# EAGLE design RaspberryPiSocket (EAGLE 7.5.0)
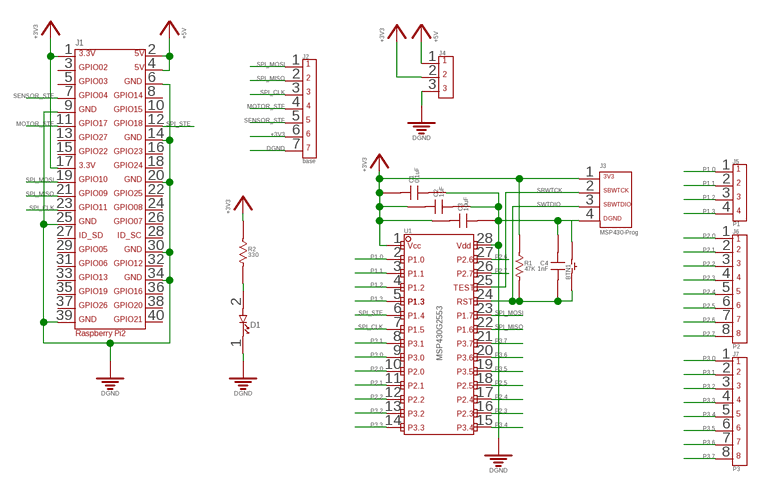
[diagram p0: schematic, sheet 1]

## Parts
BTN1  BTN_NORMAL_OFF_6_3.5_SMD  [BTN_6_3.5_SMD]
C1  0.1uF  CAPACITOR_FIXED_0805  [0805]
C2  1uF  CAPACITOR_FIXED_0805  [0805]
C3  10uF  CAPACITOR_FIXED_0805  [0805]
C4  1nF  CAPACITOR_FIXED_0805  [0805]
D1  LED_0805  [0805DIODE]
J1  RPI2  [RPI2]
J2  base  7PIN_HEADER_VERT_PITCH2.54MM_TH  [7PIN_HEADER_VERT_PITCH2.54MM_TH]
J3  MSP430-PROG_NORMAL  [4PIN_HEADER_PITCH2.54MM_TH]
J4  3PIN_HEADER_PITCH2.54MM_TH  [3PIN_HEADER_PITCH2.54MM_TH]
J5  P1  4PIN_HEADER_PITCH2.54MM_TH  [4PIN_HEADER_PITCH2.54MM_TH]
J6  P2  8PIN_HEADER_PITCH2.54MM_TH  [8PIN_HEADER_PITCH2.54MM_TH]
J7  P3  8PIN_HEADER_PITCH2.54MM_TH  [8PIN_HEADER_PITCH2.54MM_TH]
R1  47K  RESISTOR_0805  [0805]
R2  330  RESISTOR_0805  [0805]
U1  MSP430G2553_24IO_28PIN_TSSOP  [TSSOP-28]

## Nets
+3V3: C1.1 C2.1 C3.1 J1.1 J1.17 J2.6 J3.1 J4.2 R1.1 R2.1 U1.1
+5V: J1.2 J1.4 J4.1
DGND: BTN1.2 C1.2 C2.2 C3.2 C4.1 D1.1 J1.6 J1.9 J1.14 J1.20 J1.25 J1.30 J1.34 J1.39 J2.7 J3.4 J4.3 U1.28
MOTOR_STE: J1.11 J2.4
N$1: D1.2 R2.2
P1.0: J5.1 U1.2
P1.1: J5.2 U1.3
P1.2: J5.3 U1.4
P1.3: J5.4 U1.5
P2.0: J6.1 U1.10
P2.1: J6.2 U1.11
P2.2: J6.3 U1.12
P2.3: J6.4 U1.16
P2.4: J6.5 U1.17
P2.5: J6.6 U1.18
P2.6: J6.7 U1.27
P2.7: J6.8 U1.26
P3.0: J7.1 U1.9
P3.1: J7.2 U1.8
P3.2: J7.3 U1.13
P3.3: J7.4 U1.14
P3.4: J7.5 U1.15
P3.5: J7.6 U1.19
P3.6: J7.7 U1.20
P3.7: J7.8 U1.21
SBWTCK: J3.2 U1.25
SENSOR_STE: J1.7 J2.5
SPI_CLK: J1.23 J2.3 U1.7
SPI_MISO: J1.21 J2.2 U1.22
SPI_MOSI: J1.19 J2.1 U1.23
SPI_STE: J1.12 U1.6
SWTDIO: BTN1.1 C4.2 J3.3 R1.2 U1.24
Unconnected: J1.3 J1.5 J1.8 J1.10 J1.13 J1.15 J1.16 J1.18 J1.22 J1.24 J1.26 J1.27 J1.28 J1.29 J1.31 J1.32 J1.33 J1.35 J1.36 J1.37 J1.38 J1.40

## Library data of the parts
BTN1 = Switches:BTN_NORMAL_OFF
C1-C4 = Capacitors:CAPACITOR_FIXED
D1 = ivani_lib:LED
J1 = robot_lib:RPI2
J2 = Connectors:7PIN
J3 = Connectors:MSP430-PROG
J4 = Connectors:3PIN
J5 = Connectors:4PIN
J6 J7 = Connectors:8PIN
R1 R2 = Resistors:RESISTOR
U1 = MCUs:MSP430G2553_24IO_28PIN

## Board
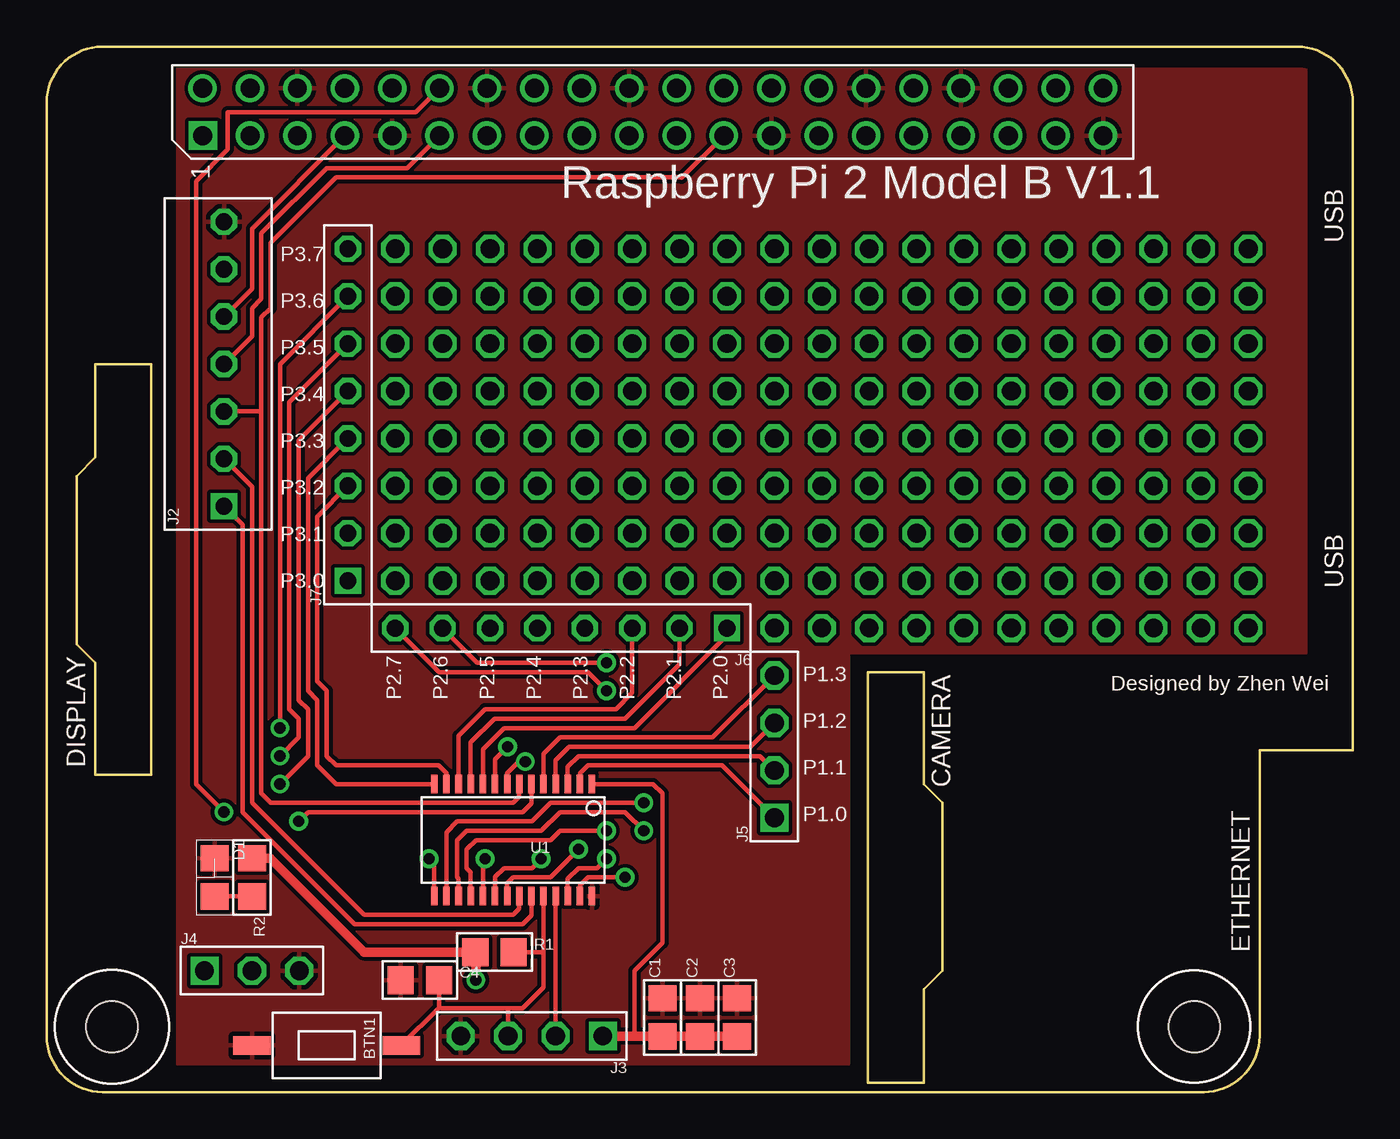
[diagram p1: board, top side]
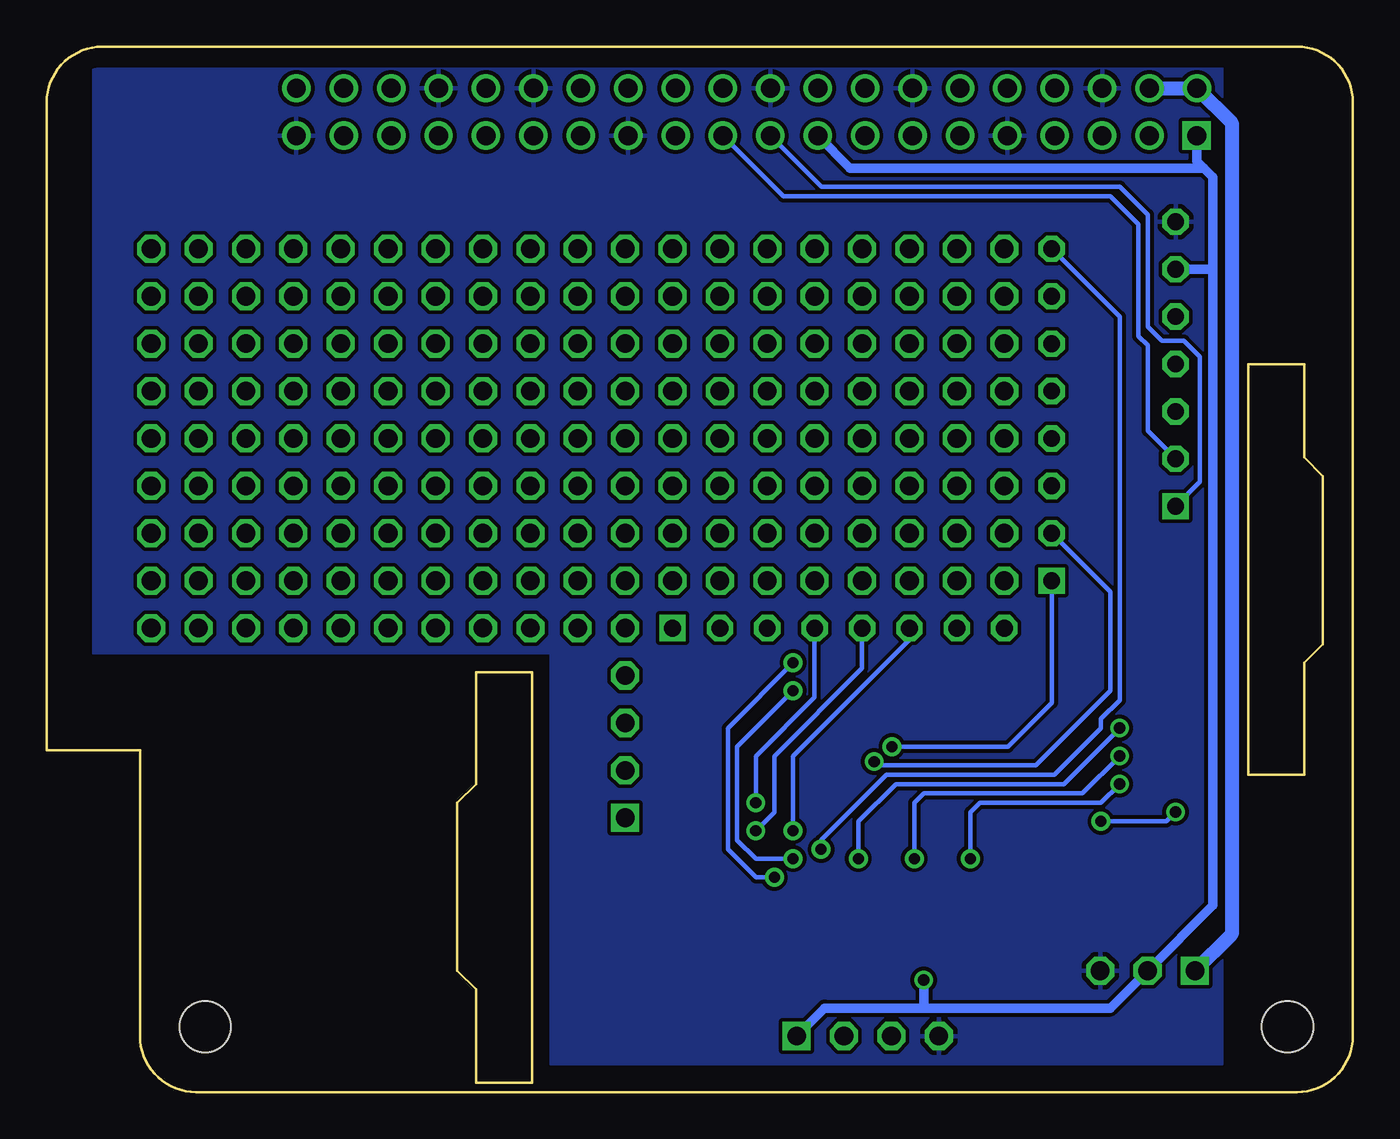
[diagram p2: board, bottom side, seen from below]

Size 70 x 56 mm. Coordinates in mm from the lower left corner, seen from the top.
Copper layers (1*16): Top 0.035mm / dielectric 1.5mm / Bottom 0.035mm
Design rules "default": minimum track width 10mil, minimum drill 24mil, track to track 8mil, track to pad 8mil, pad to pad 8mil, via to via 8mil, smd to smd 8mil, copper to edge 40mil, drill to drill 8mil, minimum pad ring 10mil, minimum via ring 8mil, stop-mask expansion 4mil, vias tented up to drill 0mil, thermal gap 10mil

### Footprints (pad centres in the part's own frame; a part is rotated, then mirrored left to right if it is on the bottom)
BTN_6_3.5_SMD = smd 1 x 2: 1 0,4; 2 0,-4
0805 = smd 1.4 x 1.5: 1 -1.025,0; 2 1.025,0
0805DIODE = smd 1.4 x 1.5: 1 -1.025,0; 2 1.025,0
RPI2 = drill 1.016 square: 1 8.37,51.23 | drill 1.016: 2 8.357,53.772; 3 10.897,51.232; 4 10.897,53.772; 5 13.437,51.232; 6 13.437,53.772; 7 15.977,51.232; 8 15.977,53.772; 9 18.517,51.232; 10 18.517,53.772; 11 21.057,51.232; 12 21.057,53.772; 13 23.597,51.232; 14 23.597,53.772; 15 26.137,51.232; 16 26.137,53.772; 17 28.677,51.232; 18 28.677,53.772; 19 31.217,51.232; 20 31.217,53.772; 21 33.757,51.232; 22 33.757,53.772; 23 36.297,51.232; 24 36.297,53.772; 25 38.837,51.232; 26 38.837,53.772; 27 41.377,51.232; 28 41.377,53.772; 29 43.917,51.232; 30 43.917,53.772; 31 46.457,51.232; 32 46.457,53.772; 33 48.997,51.232; 34 48.997,53.772; 35 51.537,51.232; 36 51.537,53.772; 37 54.077,51.232; 38 54.077,53.772; 39 56.617,51.232; 40 56.617,53.772 | hole 2.75: 3.5,3.5; 61.5,3.5
7PIN_HEADER_VERT_PITCH2.54MM_TH = drill 0.9 square: 1 -7.62,0 | drill 0.9 octagon: 2 -5.08,0; 3 -2.54,0; 4 0,0; 5 2.54,0; 6 5.08,0; 7 7.62,0
4PIN_HEADER_PITCH2.54MM_TH = drill 1 square: 1 -3.81,0 | drill 1 octagon: 2 -1.27,0; 3 1.27,0; 4 3.81,0
3PIN_HEADER_PITCH2.54MM_TH = drill 1 square: 1 -2.54,0 | drill 1 octagon: 2 0,0; 3 2.54,0
8PIN_HEADER_PITCH2.54MM_TH = drill 0.9 square: 1 -8.89,0 | drill 0.9 octagon: 2 -6.35,0; 3 -3.81,0; 4 -1.27,0; 5 1.27,0; 6 3.81,0; 7 6.35,0; 8 8.89,0
TSSOP-28 = smd 0.35 x 1: 1 -4.225,-3; 2 -3.575,-3; 3 -2.925,-3; 4 -2.275,-3; 5 -1.625,-3; 6 -0.975,-3; 7 -0.325,-3; 8 0.325,-3; 9 0.975,-3; 10 1.625,-3; 11 2.275,-3; 12 2.925,-3; 13 3.575,-3; 14 4.225,-3; 15 4.225,3; 16 3.575,3; 17 2.925,3; 18 2.275,3; 19 1.625,3; 20 0.975,3; 21 0.325,3; 22 -0.325,3; 23 -0.975,3; 24 -1.625,3; 25 -2.275,3; 26 -2.925,3; 27 -3.575,3; 28 -4.225,3

### Placement (x,y rotation side)
BTN1  15,2.5 270 top
C1  33,4 90 top
C2  35,4 90 top
C3  37,4 90 top
C4  20,6 0 top
D1  9,11.5 270 top
J1  0,0 0 top
J2  9.5,39 90 top
J3  26,3 180 top
J4  11,6.5 0 top
J5  39,18.5 90 top
J6  27.57,24.85 180 top
J7  16.14,36.28 90 top
R1  24,7.5 0 top
R2  11,11.5 270 top
U1  25,13.5 180 top

### Tracks (layer width: path | path; a pad name or v marks a point on that pad's centre or on a via)
+3V3  (via drill 0.6)
  Top 0.254: U1.1 32.5,16.5 33,16 33,8 31.5,6.5 31.5,3
  Top 0.508: C3.1 C2.1 C1.1 32.98,3 31.5,3 J3.1 | v23,6 23,7.47 R1.1 17,7.5 11.97,12.53 R2.1
  Bottom 0.508: J2.6 7.5,44.08 | J3.1 28.31,4.5 23,4.5 | 23,4.5 13,4.5 J4.2 7.5,10 7.5,44.08 | 8,49.5 26.95,49.5 J1.17 | 8,49.5 7.5,49 7.5,44.08 | 8,49.5 8.37,49.87 J1.1 | v23,6 23,4.5
+5V
  Bottom 0.756: J1.4 J1.2 6.5,51.91 6.5,8.46 J4.1
DGND
  pour Top: 7,55 67.5,55 67.5,23.5 43,23.5 43,1.5 7,1.5
  pour Bottom: 7,55 67.5,55 67.5,23.5 43,23.5 43,1.5 7,1.5
MOTOR_STE
  Top 0.254: J2.4 11,40.5 11,42 11.5,42.5 11.5,46 15,49.5 19.32,49.5 J1.11
N$1
  Top 0.254: R2.2 D1.2
N$2  (via drill 1)
  other vias: 18.68,35.01
N$3  (via drill 1)
  other vias: 18.68,27.39
N$4  (via drill 1)
  other vias: 18.68,29.93
N$5  (via drill 1)
  other vias: 18.68,32.47
N$6  (via drill 1)
  other vias: 18.68,37.55
N$7  (via drill 1)
  other vias: 18.68,40.09
N$8  (via drill 1)
  other vias: 18.68,42.63
N$9  (via drill 1)
  other vias: 18.68,45.17
N$10  (via drill 1)
  other vias: 21.22,27.39
N$11  (via drill 1)
  other vias: 21.22,29.93
N$12  (via drill 1)
  other vias: 21.22,32.47
N$13  (via drill 1)
  other vias: 21.22,35.01
N$14  (via drill 1)
  other vias: 21.22,37.55
N$15  (via drill 1)
  other vias: 21.22,40.09
N$16  (via drill 1)
  other vias: 21.22,42.63
N$17  (via drill 1)
  other vias: 21.22,45.17
N$18  (via drill 1)
  other vias: 23.76,27.39
N$19  (via drill 1)
  other vias: 23.76,29.93
N$20  (via drill 1)
  other vias: 23.76,32.47
N$21  (via drill 1)
  other vias: 23.76,35.01
N$22  (via drill 1)
  other vias: 23.76,37.55
N$23  (via drill 1)
  other vias: 23.76,40.09
N$24  (via drill 1)
  other vias: 23.76,42.63
N$25  (via drill 1)
  other vias: 23.76,45.17
N$26  (via drill 1)
  other vias: 26.3,27.39
N$27  (via drill 1)
  other vias: 26.3,29.93
N$28  (via drill 1)
  other vias: 26.3,32.47
N$29  (via drill 1)
  other vias: 26.3,35.01
N$30  (via drill 1)
  other vias: 26.3,37.55
N$31  (via drill 1)
  other vias: 26.3,40.09
N$32  (via drill 1)
  other vias: 26.3,42.63
N$33  (via drill 1)
  other vias: 26.3,45.17
N$34  (via drill 1)
  other vias: 28.84,27.39
N$35  (via drill 1)
  other vias: 28.84,29.93
N$36  (via drill 1)
  other vias: 28.84,32.47
N$37  (via drill 1)
  other vias: 28.84,35.01
N$38  (via drill 1)
  other vias: 28.84,37.55
N$39  (via drill 1)
  other vias: 28.84,40.09
N$40  (via drill 1)
  other vias: 28.84,42.63
N$41  (via drill 1)
  other vias: 28.84,45.17
N$42  (via drill 1)
  other vias: 31.38,27.39
N$43  (via drill 1)
  other vias: 31.38,29.93
N$44  (via drill 1)
  other vias: 31.38,32.47
N$45  (via drill 1)
  other vias: 31.38,35.01
N$46  (via drill 1)
  other vias: 31.38,37.55
N$47  (via drill 1)
  other vias: 31.38,40.09
N$48  (via drill 1)
  other vias: 31.38,42.63
N$49  (via drill 1)
  other vias: 31.38,45.17
N$50  (via drill 1)
  other vias: 33.92,27.39
N$51  (via drill 1)
  other vias: 33.92,29.93
N$52  (via drill 1)
  other vias: 33.92,32.47
N$53  (via drill 1)
  other vias: 33.92,35.01
N$54  (via drill 1)
  other vias: 33.92,37.55
N$55  (via drill 1)
  other vias: 33.92,40.09
N$56  (via drill 1)
  other vias: 33.92,42.63
N$57  (via drill 1)
  other vias: 33.92,45.17
N$58  (via drill 1)
  other vias: 36.46,27.39
N$59  (via drill 1)
  other vias: 36.46,29.93
N$60  (via drill 1)
  other vias: 36.46,32.47
N$61  (via drill 1)
  other vias: 36.46,35.01
N$62  (via drill 1)
  other vias: 36.46,37.55
N$63  (via drill 1)
  other vias: 36.46,40.09
N$64  (via drill 1)
  other vias: 36.46,42.63
N$65  (via drill 1)
  other vias: 36.46,45.17
N$66  (via drill 1)
  other vias: 39,24.85
N$67  (via drill 1)
  other vias: 39,27.39
N$68  (via drill 1)
  other vias: 39,29.93
N$69  (via drill 1)
  other vias: 39,32.47
N$70  (via drill 1)
  other vias: 39,35.01
N$71  (via drill 1)
  other vias: 39,37.55
N$72  (via drill 1)
  other vias: 39,40.09
N$73  (via drill 1)
  other vias: 39,42.63
N$74  (via drill 1)
  other vias: 39,45.17
N$75  (via drill 1)
  other vias: 41.54,24.85
N$76  (via drill 1)
  other vias: 41.54,27.39
N$77  (via drill 1)
  other vias: 41.54,29.93
N$78  (via drill 1)
  other vias: 41.54,32.47
N$79  (via drill 1)
  other vias: 41.54,35.01
N$80  (via drill 1)
  other vias: 41.54,37.55
N$81  (via drill 1)
  other vias: 41.54,40.09
N$82  (via drill 1)
  other vias: 41.54,42.63
N$83  (via drill 1)
  other vias: 41.54,45.17
N$84  (via drill 1)
  other vias: 44.08,24.85
N$85  (via drill 1)
  other vias: 44.08,27.39
N$86  (via drill 1)
  other vias: 44.08,29.93
N$87  (via drill 1)
  other vias: 44.08,32.47
N$88  (via drill 1)
  other vias: 44.08,35.01
N$89  (via drill 1)
  other vias: 44.08,37.55
N$90  (via drill 1)
  other vias: 44.08,40.09
N$91  (via drill 1)
  other vias: 44.08,42.63
N$92  (via drill 1)
  other vias: 44.08,45.17
N$93  (via drill 1)
  other vias: 46.62,24.85
N$94  (via drill 1)
  other vias: 46.62,27.39
N$95  (via drill 1)
  other vias: 46.62,29.93
N$96  (via drill 1)
  other vias: 46.62,32.47
N$97  (via drill 1)
  other vias: 46.62,35.01
N$98  (via drill 1)
  other vias: 46.62,37.55
N$99  (via drill 1)
  other vias: 46.62,40.09
N$100  (via drill 1)
  other vias: 46.62,42.63
N$101  (via drill 1)
  other vias: 46.62,45.17
N$102  (via drill 1)
  other vias: 49.16,24.85
N$103  (via drill 1)
  other vias: 49.16,27.39
N$104  (via drill 1)
  other vias: 49.16,29.93
N$105  (via drill 1)
  other vias: 49.16,32.47
N$106  (via drill 1)
  other vias: 49.16,35.01
N$107  (via drill 1)
  other vias: 49.16,37.55
N$108  (via drill 1)
  other vias: 49.16,40.09
N$109  (via drill 1)
  other vias: 49.16,42.63
N$110  (via drill 1)
  other vias: 49.16,45.17
N$111  (via drill 1)
  other vias: 51.7,24.85
N$112  (via drill 1)
  other vias: 51.7,27.39
N$113  (via drill 1)
  other vias: 51.7,29.93
N$114  (via drill 1)
  other vias: 51.7,32.47
N$115  (via drill 1)
  other vias: 51.7,35.01
N$116  (via drill 1)
  other vias: 51.7,37.55
N$117  (via drill 1)
  other vias: 51.7,40.09
N$118  (via drill 1)
  other vias: 51.7,42.63
N$119  (via drill 1)
  other vias: 51.7,45.17
N$120  (via drill 1)
  other vias: 54.24,24.85
N$121  (via drill 1)
  other vias: 54.24,27.39
N$122  (via drill 1)
  other vias: 54.24,29.93
N$123  (via drill 1)
  other vias: 54.24,32.47
N$124  (via drill 1)
  other vias: 54.24,35.01
N$125  (via drill 1)
  other vias: 54.24,37.55
N$126  (via drill 1)
  other vias: 54.24,40.09
N$127  (via drill 1)
  other vias: 54.24,42.63
N$128  (via drill 1)
  other vias: 54.24,45.17
N$129  (via drill 1)
  other vias: 56.78,24.85
N$130  (via drill 1)
  other vias: 56.78,27.39
N$131  (via drill 1)
  other vias: 56.78,29.93
N$132  (via drill 1)
  other vias: 56.78,32.47
N$133  (via drill 1)
  other vias: 56.78,35.01
N$134  (via drill 1)
  other vias: 56.78,37.55
N$135  (via drill 1)
  other vias: 56.78,40.09
N$136  (via drill 1)
  other vias: 56.78,42.63
N$137  (via drill 1)
  other vias: 56.78,45.17
N$138  (via drill 1)
  other vias: 59.32,24.85
N$139  (via drill 1)
  other vias: 59.32,27.39
N$140  (via drill 1)
  other vias: 59.32,29.93
N$141  (via drill 1)
  other vias: 59.32,32.47
N$142  (via drill 1)
  other vias: 59.32,35.01
N$143  (via drill 1)
  other vias: 59.32,37.55
N$144  (via drill 1)
  other vias: 59.32,40.09
N$145  (via drill 1)
  other vias: 59.32,42.63
N$146  (via drill 1)
  other vias: 59.32,45.17
N$147  (via drill 1)
  other vias: 61.86,24.85
N$148  (via drill 1)
  other vias: 61.86,27.39
N$149  (via drill 1)
  other vias: 61.86,29.93
N$150  (via drill 1)
  other vias: 61.86,32.47
N$151  (via drill 1)
  other vias: 61.86,35.01
N$152  (via drill 1)
  other vias: 61.86,37.55
N$153  (via drill 1)
  other vias: 61.86,40.09
N$154  (via drill 1)
  other vias: 61.86,42.63
N$155  (via drill 1)
  other vias: 61.86,45.17
N$156  (via drill 1)
  other vias: 64.4,24.85
N$157  (via drill 1)
  other vias: 64.4,27.39
N$158  (via drill 1)
  other vias: 64.4,29.93
N$159  (via drill 1)
  other vias: 64.4,32.47
N$160  (via drill 1)
  other vias: 64.4,35.01
N$161  (via drill 1)
  other vias: 64.4,37.55
N$162  (via drill 1)
  other vias: 64.4,40.09
N$163  (via drill 1)
  other vias: 64.4,42.63
N$164  (via drill 1)
  other vias: 64.4,45.17
P1.0
  Top 0.254: U1.2 28.57,17.07 29,17.5 36.19,17.5 J5.1
P1.1
  Top 0.254: U1.3 27.93,17.43 28.5,18 38.23,18 J5.2
P1.2
  Top 0.254: U1.4 27.27,17.77 28,18.5 37.73,18.5 J5.3
P1.3
  Top 0.254: U1.5 26.62,18.12 27.5,19 35.69,19 J5.4
P2.0
  Top 0.254: U1.10 23.38,18.38 24.5,19.5 31.5,19.5 36.46,24.46 J6.1
P2.1
  Top 0.254: U1.11 22.73,18.73 24,20 31,20 33.92,22.92 J6.2
P2.2
  Top 0.254: U1.12 22.07,19.07 23.5,20.5 30.5,20.5 31.38,21.38 J6.3
P2.3  (via drill 0.6)
  Top 0.254: v32,15.5 27,15.5 26,14.5 22,14.5 21.43,13.93 U1.16
  Bottom 0.254: v32,15.5 32,18 28.84,21.16 J6.4
P2.4  (via drill 0.6)
  Top 0.254: U1.17 22.07,11.43 22,11.5 22,13.5 22.5,14 26.5,14 27.5,15 31,15 v32,14
  Bottom 0.254: v32,14 31,15 31,18 26.3,22.7 J6.5
P2.5  (via drill 0.6)
  Top 0.254: v30,14 27.5,14 27,13.5 23,13.5 22.5,13 22.5,12 22.73,11.78 U1.18
  Bottom 0.254: v30,14 30,18 23.76,24.24 J6.6
P2.6  (via drill 0.6)
  Top 0.254: U1.27 28.57,11.07 29,11.5 v31,11.5 | v30,23 23.07,23 J6.7
  Bottom 0.254: v31,11.5 32,11.5 33.5,13 33.5,19.5 v30,23
P2.7  (via drill 0.6)
  Top 0.254: U1.26 27.93,11.43 28.5,12 29.5,12 v30,12.5 | v30,21.5 29,22.5 21.03,22.5 J6.8
  Bottom 0.254: v30,21.5 33,18.5 33,13.5 32,12.5 v30,12.5
P3.0  (via drill 0.6)
  Top 0.254: U1.9 24.02,17.82 v24.7,18.5
  Bottom 0.254: v24.7,18.5 18.5,18.5 16.14,20.86 J7.1
P3.1  (via drill 0.6)
  Top 0.254: U1.8 24.68,17.07 25.3,17.7 v25.65,17.7
  Bottom 0.254: v25.65,17.7 25.45,17.5 17,17.5 13,21.5 13,26.79 J7.2
P3.2
  Top 0.254: U1.13 21.43,17.07 21,17.5 15.5,17.5 15,18 15,21.5 14.5,22 14.5,30.83 J7.3
P3.3
  Top 0.254: U1.14 15.5,16.5 14.5,17.5 14.5,21 14,21.5 14,32.87 J7.4
P3.4  (via drill 0.6)
  Top 0.254: U1.15 20.77,12.22 v20.5,12.5 | v12.5,16.5 14,18 14,20.5 13.5,21 13.5,34.91 J7.5
  Bottom 0.254: v20.5,12.5 20.5,15 20,15.5 13.5,15.5 v12.5,16.5
P3.5  (via drill 0.6)
  Top 0.254: U1.19 23.38,12.38 v23.5,12.5 | v12.5,18 13.5,19 13.5,20 13,20.5 13,36.95 J7.6
  Bottom 0.254: v23.5,12.5 23.5,15.5 23,16 14.5,16 v12.5,18
P3.6  (via drill 0.6)
  Top 0.254: U1.20 24.02,11.53 24.5,12 26,12 v26.5,12.5 | v12.5,19.5 12.5,38.99 J7.7
  Bottom 0.254: v26.5,12.5 26.5,14.5 24.5,16.5 15.5,16.5 v12.5,19.5
P3.7  (via drill 0.6)
  Top 0.254: U1.21 24.68,11.18 25,11.5 27,11.5 v28.5,13
  Bottom 0.254: v28.5,13 28.5,13.5 25,17 16,17 13.5,19.5 13.5,20 12.5,21 12.5,41.53 J7.8
SBWTCK
  Top 0.254: U1.25 J3.2
SENSOR_STE
  Top 0.254: J2.5 11,43.04 11,46.26 J1.7
SPI_CLK
  Top 0.254: J1.23 34.03,48.97 34,49 15.5,49 12,45.5 12,42 11.5,41.5 11.5,36.5 | 11.5,36.5 11.5,16 12,15.5 25,15.5 25.32,15.82 U1.7 | J2.3 11.46,36.46 11.5,36.5
SPI_MISO
  Top 0.254: J2.2 11,32.42 11,15.5 17,9.5 25,9.5 25.32,9.82 U1.22
  Bottom 0.254: J2.2 11,35.42 11,40 11.5,40.5 11.5,46.5 13,48 30.52,48 J1.21
SPI_MOSI
  Top 0.254: J2.1 10.5,30.38 10.5,15 16.5,9 25.5,9 25.98,9.47 U1.23
  Bottom 0.254: J2.1 8.2,32.68 8.2,39.4 9.05,40.25 10.25,40.25 11,41 11,47 12.5,48.5 28.48,48.5 J1.19
SPI_STE  (via drill 0.6)
  Top 0.254: v9.5,15 8,16.5 8,48.8 9.7,50.5 9.7,52.5 19.79,52.5 J1.12 | v13.5,14.5 14,15 25.5,15 25.98,15.47 U1.6
  Bottom 0.254: v9.5,15 10,14.5 v13.5,14.5
SWTDIO
  Top 0.254: 19.02,2.5 BTN1.1 21,4.5 | J3.3 24.73,4.5 | 24.73,4.5 21,4.5 | U1.24 26.62,7.5 | 26.62,7.5 26.62,5.62 25.5,4.5 24.73,4.5 | R1.2 26.62,7.5 | C4.2 21.02,4.53 21,4.5

### Text on the board
tPlace: P3.7 | P3.6 | P3.5 | P3.4 | P3.3 | P3.2 | P3.1 | P3.0 | P1.3 | Designed by Zhen Wei | P2.7 | P2.6 | P2.5 | P2.4 | P2.3 | P2.2 | P2.1 | P2.0 | P1.2 | P1.1 | P1.0